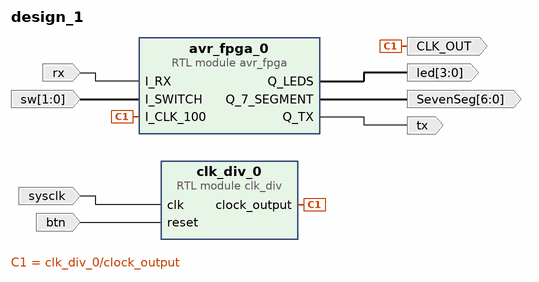
[diagram p0: block diagram of the top level]
# Vivado block design design_1, xc7z020clg400-1, Vivado 2021.1
create_bd_design design_1

create_bd_port -dir I -type clk sysclk
set_property -dict {CONFIG.ASSOCIATED_RESET btn CONFIG.FREQ_HZ 125000000} [get_bd_ports sysclk]
create_bd_port -dir I -from 1 -to 0 sw
create_bd_port -dir O -from 3 -to 0 led
create_bd_port -dir O -from 6 -to 0 SevenSeg
create_bd_port -dir I rx
create_bd_port -dir O tx
create_bd_port -dir I -type rst btn
set_property -dict {CONFIG.POLARITY ACTIVE_LOW} [get_bd_ports btn]
create_bd_port -dir O -type clk CLK_OUT
set_property -dict {CONFIG.FREQ_HZ 25000000} [get_bd_ports CLK_OUT]

create_bd_cell -type module -reference clk_div clk_div_0
set_property -dict {CONFIG.divider 5} [get_bd_cells clk_div_0]
create_bd_cell -type module -reference avr_fpga avr_fpga_0

# ---- connections ----

connect_bd_net -net I_RX_0_1 [get_bd_ports rx] [get_bd_pins avr_fpga_0/I_RX]
connect_bd_net -net I_SWITCH_0_1 [get_bd_ports sw] [get_bd_pins avr_fpga_0/I_SWITCH]
connect_bd_net [get_bd_pins avr_fpga_0/Q_7_SEGMENT] [get_bd_ports SevenSeg]
connect_bd_net [get_bd_pins avr_fpga_0/Q_LEDS] [get_bd_ports led]
connect_bd_net [get_bd_pins avr_fpga_0/Q_TX] [get_bd_ports tx]
connect_bd_net -net clk_0_1 [get_bd_ports sysclk] [get_bd_pins clk_div_0/clk]
connect_bd_net -net clk_div_0_clock_out [get_bd_pins clk_div_0/clock_output] [get_bd_ports CLK_OUT] [get_bd_pins avr_fpga_0/I_CLK_100]
connect_bd_net -net reset_0_1 [get_bd_ports btn] [get_bd_pins clk_div_0/reset]

validate_bd_design
save_bd_design
